# EAGLE design BrainA2-A-11Nov2014 (EAGLE 7.1.0)
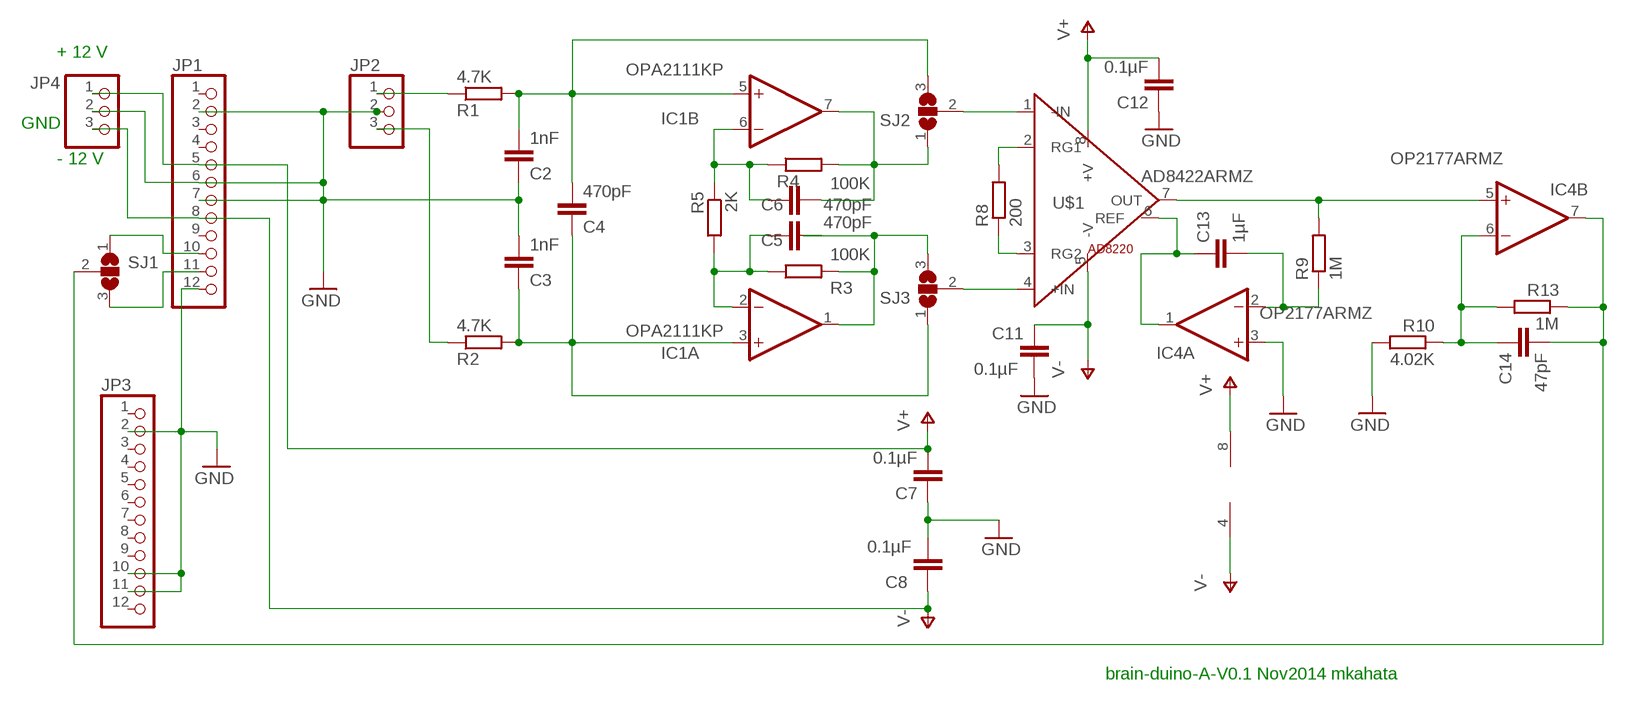
[diagram p0: schematic, sheet 1]

## Parts
C2  1nF  C-EUC0603  [C0603]
C3  1nF  C-EUC0603  [C0603]
C4  470pF  C-EUC0603  [C0603]
C5  470pF  C-EUC0603  [C0603]
C6  470pF  C-EUC0603  [C0603]
C7  0.1µF  C-EUC0603  [C0603]
C8  0.1µF  C-EUC0603  [C0603]
C11  0.1µF  C-EUC0603  [C0603]
C12  0.1µF  C-EUC0603  [C0603]
C13  1µF  C-EUC0603  [C0603]
C14  47pF  C-EUC0603  [C0603]
IC1  OPA2111KP  OPA2111P  [DIL08]
IC4  OP2177ARMZ  OP1277RM  [MSOP08]
JP1  PINHD-1X12  [1X12]
JP2  PINHD-1X3  [1X03]
JP3  PINHD-1X12  [1X12]
JP4  PINHD-1X3  [1X03]
R1  4.7K  R-EU_R0603  [R0603]
R2  4.7K  R-EU_R0603  [R0603]
R3  100K  R-EU_R0603  [R0603]
R4  100K  R-EU_R0603  [R0603]
R5  2K  R-EU_R0603  [R0603]
R8  200  R-EU_R0603  [R0603]
R9  1M  R-EU_R0603  [R0603]
R10  4.02K  R-EU_R0603  [R0603]
R13  1M  R-EU_R0603  [R0603]
SJ1  SJ2W  [SJ_2]
SJ2  SJ2W  [SJ_2]
SJ3  SJ2W  [SJ_2]
U$1  AD8422ARMZ  AD8220  [AD8220]

## Nets
GND: C2.1 C3.2 C7.1 C8.2 C11.2 C12.1 IC4.3(A:+IN) JP1.2 JP1.6 JP1.7 JP1.12 JP2.2 JP3.2 JP3.10 JP3.11 JP4.2 R10.2
N$1: JP2.1 R1.1
N$2: JP1.11 SJ1.3
N$3: JP2.3 R2.1
N$4: C3.1 C4.1 IC1.3(A:+IN) R2.2 SJ3.1
N$5: C2.2 C4.2 IC1.5(B:+IN) R1.2 SJ2.3
N$6: JP1.10 SJ1.1
N$8: C5.1 IC1.2(A:-IN) R3.1 R5.2
N$9: C6.1 IC1.6(B:-IN) R4.1 R5.1
N$14: SJ2.2 U$1.1(-IN)
N$15: SJ3.2 U$1.4(+IN)
N$17: C5.2 IC1.1(A:OUT) R3.2 SJ3.3
N$18: C6.2 IC1.7(B:OUT) R4.2 SJ2.1
N$19: R8.1 U$1.3(RG2)
N$23: R8.2 U$1.2(RG1)
N$25: IC4.5(B:+IN) R9.2 U$1.7(OUT)
N$26: C13.2 IC4.2(A:-IN) R9.1
N$28: C14.1 IC4.6(B:-IN) R10.1 R13.2
N$29: C14.2 IC4.7(B:OUT) R13.1 SJ1.2
N$30: C13.1 IC4.1(A:OUT) U$1.6(REF)
V+: C7.2 C12.2 IC4.8(P:V+) JP1.5 JP4.1 U$1.8(+V)
V-: C8.1 C11.1 IC4.4(P:V-) JP1.8 JP4.3 U$1.5(-V)
Unconnected: JP1.1 JP1.3 JP1.4 JP1.9 JP3.1 JP3.3 JP3.4 JP3.5 JP3.6 JP3.7 JP3.8 JP3.9 JP3.12

## Notes on the sheet
- + 12 V
- GND
- - 12 V
- brain-duino-A-V0.1 Nov2014 mkahata

## Power pins joined to a net without a drawn wire
V+: IC1.8(P:V+)
V-: IC1.4(P:V-)

## Library data of the parts
C2-C8 C11-C14 = rcl:C-EU: CAPACITOR, European symbol
IC1 = linear:OPA2111: OP AMP
IC4 = linear:OP1277: Precision Low Noise, Low Input Bias Current Operational Amplifiers Source: OP1177_2177_4177.pdf
JP1 JP3 = pinhead:PINHD-1X12: PIN HEADER
JP2 JP4 = pinhead:PINHD-1X3: PIN HEADER
R1-R5 R8-R10 R13 = rcl:R-EU_: RESISTOR, European symbol
SJ1-SJ3 = jumper:SJ2W: SMD solder JUMPER
U$1 = MKH:AD8220: IN-AMP{

## Net classes
0 default: clearance 0.205 mm

## Board
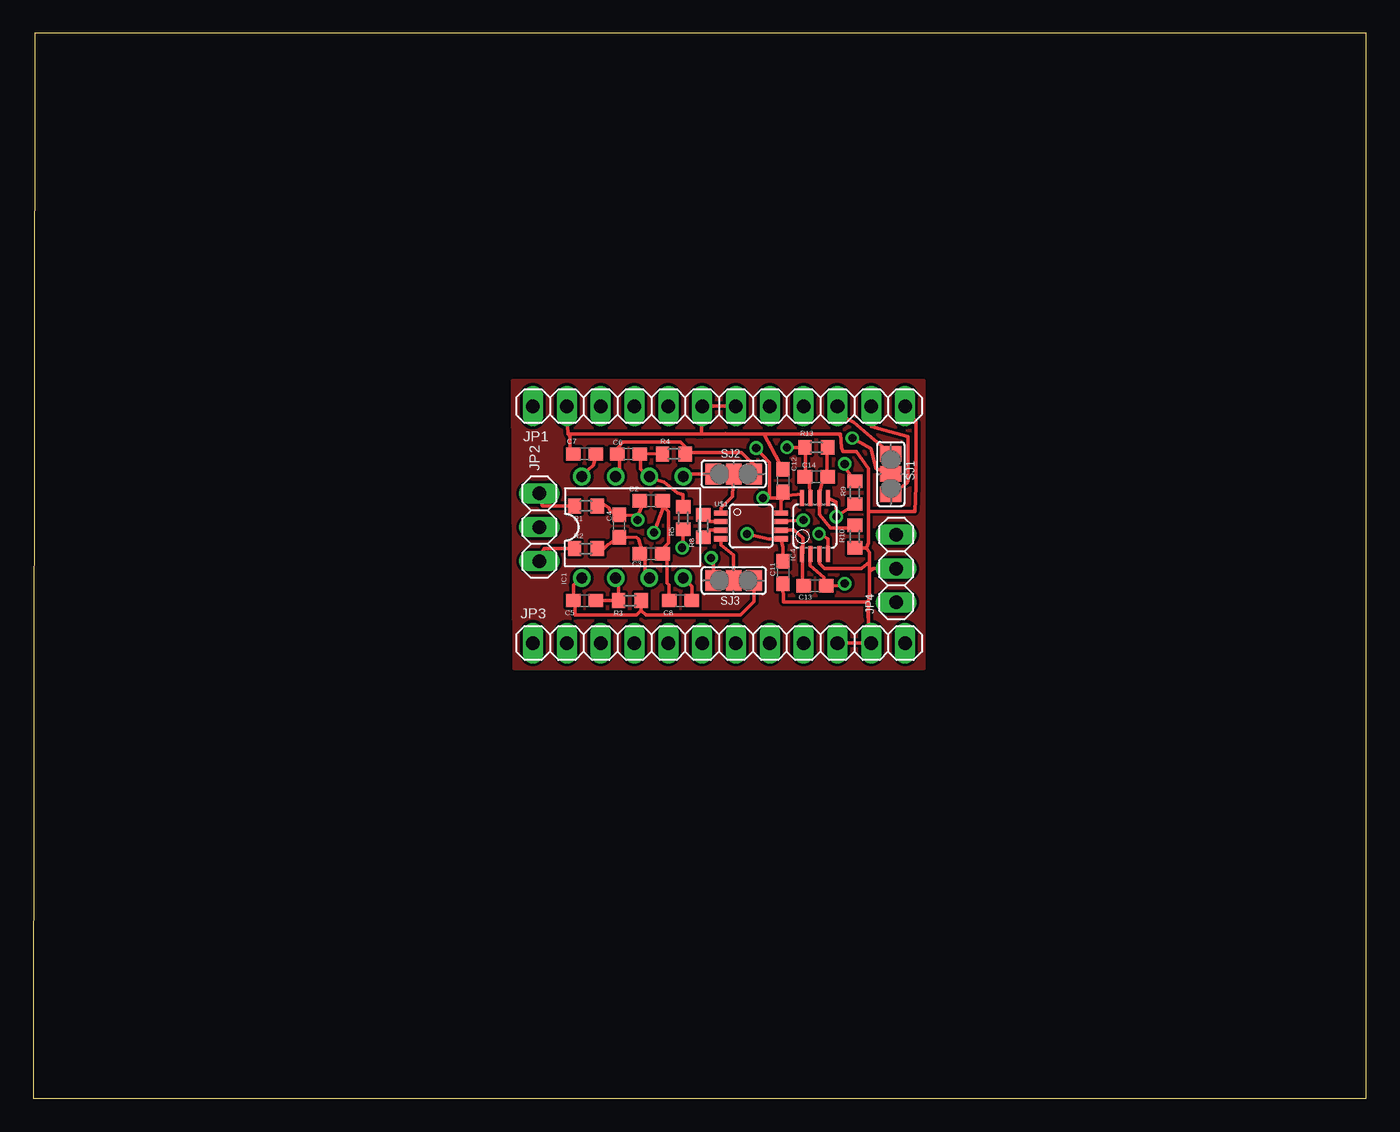
[diagram p1: board, top side]
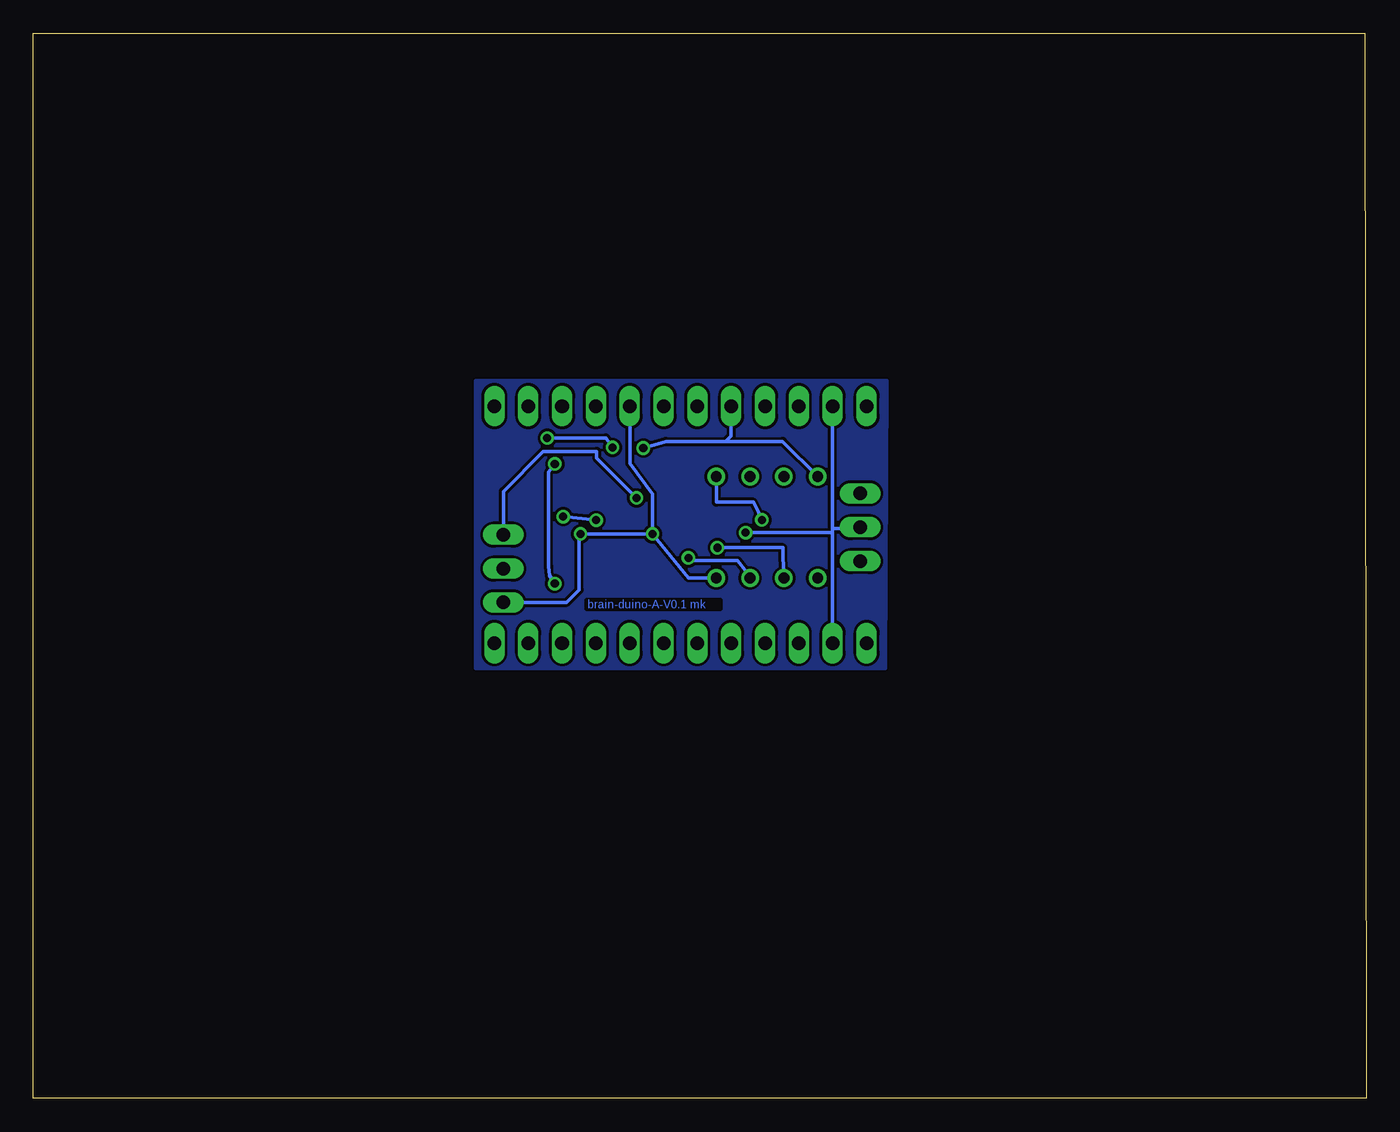
[diagram p2: board, bottom side, seen from below]

Size 100.1 x 80 mm. Coordinates in mm from the lower left corner, seen from the top.
Outline: 0,0 100.1,0 100.1,80 0.1,80 0,0
Copper layers (1*16): Top 0.035mm / dielectric 1.5mm / Bottom 0.035mm
Design rules "default": minimum track width 10mil, minimum drill 24mil, track to track 8mil, track to pad 8mil, pad to pad 8mil, via to via 8mil, smd to smd 8mil, copper to edge 40mil, drill to drill 8mil, minimum pad ring 10mil, minimum via ring 8mil, stop-mask expansion 4mil, vias tented up to drill 0mil, thermal gap 10mil

### Footprints (pad centres in the part's own frame; a part is rotated, then mirrored left to right if it is on the bottom)
C0603 = smd 1.1 x 1: 1 -0.85,0; 2 0.85,0
DIL08 = drill 0.813 pad 1.27: 1 -3.81,-3.81; 2 -1.27,-3.81; 3 1.27,-3.81; 4 3.81,-3.81; 5 3.81,3.81; 6 1.27,3.81; 7 -1.27,3.81; 8 -3.81,3.81
MSOP08 = smd 0.3 x 1.2: 1 -0.976,-2.113; 2 -0.326,-2.113; 3 0.324,-2.113; 4 0.974,-2.113; 5 0.974,2.112; 6 0.324,2.112; 7 -0.326,2.112; 8 -0.976,2.112
1X12 = drill 1.016 long: 1 -13.97,0; 2 -11.43,0; 3 -8.89,0; 4 -6.35,0; 5 -3.81,0; 6 -1.27,0; 7 1.27,0; 8 3.81,0; 9 6.35,0; 10 8.89,0; 11 11.43,0; 12 13.97,0
1X03 = drill 1.016 long: 1 -2.54,0; 2 0,0; 3 2.54,0
R0603 = smd 1 x 1.1: 1 -0.85,0; 2 0.85,0
SJ_2 = smd 1.168 x 1.6: 1 -1.524,0; 2 0,0; 3 1.524,0
AD8220 = smd 0.4 x 1: 1 -0.976,-2.263; 2 -0.326,-2.263; 3 0.324,-2.263; 4 0.974,-2.263; 5 0.974,2.262; 6 0.324,2.262; 7 -0.326,2.262; 8 -0.976,2.262

### Placement (x,y rotation side)
C2  46.4,44.9 180 top
C3  46.4,40.9 0 top
C4  44,43 90 top
C5  41.4,37.4 180 top
C6  44.7,48.4 180 top
C7  41.4,48.4 0 top
C8  48.6,37.4 180 top
C11  56.3,39.5 270 top
C12  56.3,46.4 270 top
C13  58.7,38.5 0 top
C14  58.8,46.7 180 top
IC1  45,42.9 0 top
IC4  58.7,43 0 top
JP1  51.5,52 0 top
JP2  38,42.9 270 top
JP3  51.5,34.2 0 top
JP4  64.8,39.8 270 top
R1  41.5,44.5 0 top
R2  41.5,41.3 0 top
R3  44.8,37.4 0 top
R4  48.1,48.4 0 top
R5  48.8,43.6 270 top
R8  50.3,43 90 top
R9  61.7,45.5 270 top
R10  61.7,42.2 270 top
R13  58.8,48.9 0 top
SJ1  64.4,46.9 270 top
SJ2  52.6,46.9 180 top
SJ3  52.6,38.9 0 top
U$1  53.9,43 270 top

### Tracks (layer width: path | path; a pad name or v marks a point on that pad's centre or on a via)
GND  (via drill 0.6)
  Top 0.254: IC4.3 59.02,40.18 59.4,39.8 62.2,39.8 62.8,40.3 | 40.57,48.42 C7.1 40.3,48.25 40.3,49.7 40.17,49.9 | C12.1 54.88,49.9 51.98,49.94 50.18,49.92 | 50.18,49.92 49.9,49.9 | 52.73,51.96 JP1.7 JP1.6 50.18,51.95 50.18,49.92 | 50.18,49.9 50.18,49.92 | 62.55,41.35 62.7,41.7 62.7,44.1 | 62.7,44.1 62.7,47.3 61.8,48.6 60.8,48.6 60.7,48.9 60.6,49.9 50.18,49.9 | R10.2 62.55,41.35 | 62.55,41.35 62.8,41 62.8,40.3 | 62.8,40.3 62.8,39.6 | 62.8,39.6 62.8,38 62.7,37.3 | 62.7,37.3 56.35,37.3 C11.2 | JP1.12 66.27,50.83 66.3,46 66.2,44.1 62.7,44.1 | JP3.10 JP3.11 62.7,34.43 62.7,37.3 | 49.9,49.9 40.17,49.9 | 40.17,49.9 40.07,51.2 JP1.2 | C8.2 47.75,38.55 47.6,38.7 47.6,40.55 C3.2 47.4,41.05 47.4,41.4 47.7,41.7 47.7,44.1 47.25,44.55 C2.1 47.25,44.25 v46.6,42.5 | 62.69,36.11 62.69,36.39 62.7,37.3 | 49.9,49.9 50.18,49.9 | JP4.2 63.1,39.8 62.8,39.6
  Bottom 0.254: 50.2,52.09 JP1.6 | JP3.2 40.07,42.6 | 40.07,42.6 40.07,42.8 | 40.07,42.8 JP1.2 | JP2.2 38.57,42.8 40.07,42.8 | v46.6,42.5 40.17,42.5 40.07,42.6
N$1
  Top 0.254: R1.1 38.26,44.5 JP2.1
N$2
  Top 0.254: JP1.11 62.93,50.47 63.9,50.2 65.7,49.7 65.7,46.4 65.6,46.22 SJ1.3
N$3
  Top 0.254: R2.1 40.65,41.05 40.4,41.3 38.36,41.3 JP2.3
N$4  (via drill 0.6)
  Top 0.254: R2.2 42.63,41.08 43.12,41.58 43.37,41.72 C4.1 45.3,42.12 45.46,42.02 45.73,41.15 C3.1 45.93,40.72 45.93,39.47 46.3,39.24 IC1.3 | v50.9,40.6 50.94,40.34 51.08,40.08 SJ3.1
  Bottom 0.254: v50.9,40.6 50.6,40.4 47.2,40.4 46.5,39.5 46.3,39.02 IC1.3
N$5  (via drill 0.61)
  Top 0.254: R1.2 42.63,44.75 43.22,44.35 43.37,44.1 C4.2 44.1,43.8 45.41,43.82 | 45.41,43.82 45.84,44.75 45.85,44.73 C2.2 | 45.41,43.82 v45.38,43.45 | SJ2.3 49,46.9 IC1.5
  Bottom 0.254: v45.38,43.45 45.65,44.04 46.02,44.78 48.8,44.78 IC1.5
N$6
  Top 0.254: JP1.10 60.39,51.41 61.6,50.8 62.9,49.68 SJ1.1
N$8  (via drill 0.61)
  Top 0.254: v48.73,41.36 48.79,41.66 R5.2 | C5.1 R3.1 43.95,38.87 IC1.2
  Bottom 0.254: v48.73,41.36 43.8,41.36 43.78,39.24 IC1.2
N$9
  Top 0.254: R5.1 48.79,44.57 48.8,45.37 48.37,45.47 47.35,46.28 46.32,46.6 IC1.6 46.07,46.81 45.62,47.27 45.62,47.96 | 45.62,47.96 C6.1 | 45.62,47.96 45.69,48.44 R4.1
N$10
  pour Bottom: 36,53.9 66.9,53.9 66.9,32.3 36.1,32.3
N$11
  pour Top: 36,53.9 66.9,53.9 66.9,32.3 36.1,32.3
N$14
  Top 0.254: U$1.1 51.64,44.34 52.5,45.2 SJ2.2
N$15
  Top 0.254: U$1.4 51.64,41.56 52.6,40.8 SJ3.2
N$17
  Top 0.254: IC1.1 41.02,39.01 40.57,38.55 40.57,37.86 C5.2 40.7,37.25 40.7,36.3 45.3,36.3 45.65,36.65 | R3.2 45.65,36.65 | SJ3.3 54.12,37.32 53.1,36.3 46,36.3 45.65,36.65
N$18
  Top 0.254: 44.01,48.19 C6.2 | C6.2 44.01,47.96 44.01,47.04 43.78,46.81 IC1.7 | C6.2 43.9,48.25 43.9,48.9 44.3,49.3 48.6,49.3 48.95,48.95 R4.2 49.25,48.5 53.2,48.5 53.66,48.04 54.18,47.62 SJ2.1
N$19
  Top 0.254: U$1.3 50.83,42.68 R8.1
N$23
  Top 0.254: U$1.2 50.82,43.33 R8.2
N$25  (via drill 0.6)
  Top 0.254: U$1.7 v57.83,43.43 | R9.2 61.65,44.6 v60.3,43.7 60.29,44.81 IC4.5
  Bottom 0.254: v57.83,43.43 v60.3,43.7
N$26  (via drill 0.61)
  Top 0.254: IC4.2 58.34,40.72 58.34,40.03 59.36,39.11 59.36,38.65 C13.2 60.69,38.52 v60.94,38.67 | v60.93,47.66 60.88,47.51 R9.1
  Bottom 0.254: v60.93,47.66 61.4,47.06 61.4,39.97 61.33,39.27 v60.94,38.67
N$28
  Top 0.254: R13.2 59.59,48.64 59.59,47.14 C14.1 59.59,46.91 59.29,46.52 59.13,45.77 59.03,45.58 IC4.6 59.03,44.45 59.03,43.86 59.86,42.83 61.16,42.83 R10.1
N$29  (via drill 0.6)
  Top 0.254: IC4.7 58.34,45.48 58.24,46.65 57.98,46.91 C14.2 57.98,47.14 57.98,48.54 R13.1 v56.6,48.9 | SJ1.2 63.3,47.3 62.9,48.8 v61.5,49.6
  Bottom 0.254: v61.5,49.6 57.1,49.6 v56.6,48.9
N$30
  Top 0.254: C13.1 57.75,38.65 57.75,40.72 IC4.1 57.8,40.96 57.8,42.1 57.12,42.68 U$1.6
V+  (via drill 0.6, 0.61)
  Top 0.254: C7.2 42.08,47.55 41.25,46.81 IC1.8 | v54.29,48.85 55.3,47.75 55.3,45.1 v54.8,45.1 55.7,45.1 56.19,45.1 C12.2 56.25,45.7 56,45.8 56.16,45.44 56.16,44.86 | U$1.8 56.16,44.86 | 56.16,44.86 56.6,45.3 57.74,45.4 IC4.8
  Bottom 0.254: 48.1,49.35 52.59,49.35 v54.29,48.85 | 48.1,49.35 43.83,49.35 IC1.8 | JP1.5 47.69,49.76 48.1,49.35 | JP4.1 64.8,45.6 61.8,48.6 57.8,48.6 57.8,48.1 v54.8,45.1
V-  (via drill 0.6)
  Top 0.254: IC4.4 59.67,42.03 59.1,42.4 v59,42.4 | v53.6,42.4 54.9,42.1 55.23,42.03 U$1.5 56.3,41.39 C11.1 | C8.1 49.45,38.45 IC1.4
  Bottom 0.254: v53.6,42.4 v59,42.4 59.1,42.3 59.1,38.2 60.04,37.26 JP4.3 | IC1.4 50.89,39.09 v53.6,42.4 | v53.6,42.4 53.6,45.4 55.3,47.7 JP1.8

### Text on the board
Bottom: brain-duino-A-V0.1 mk